# EAGLE design incandescentDriver (EAGLE 6.4)
DATABASE: ../partsdb.txt
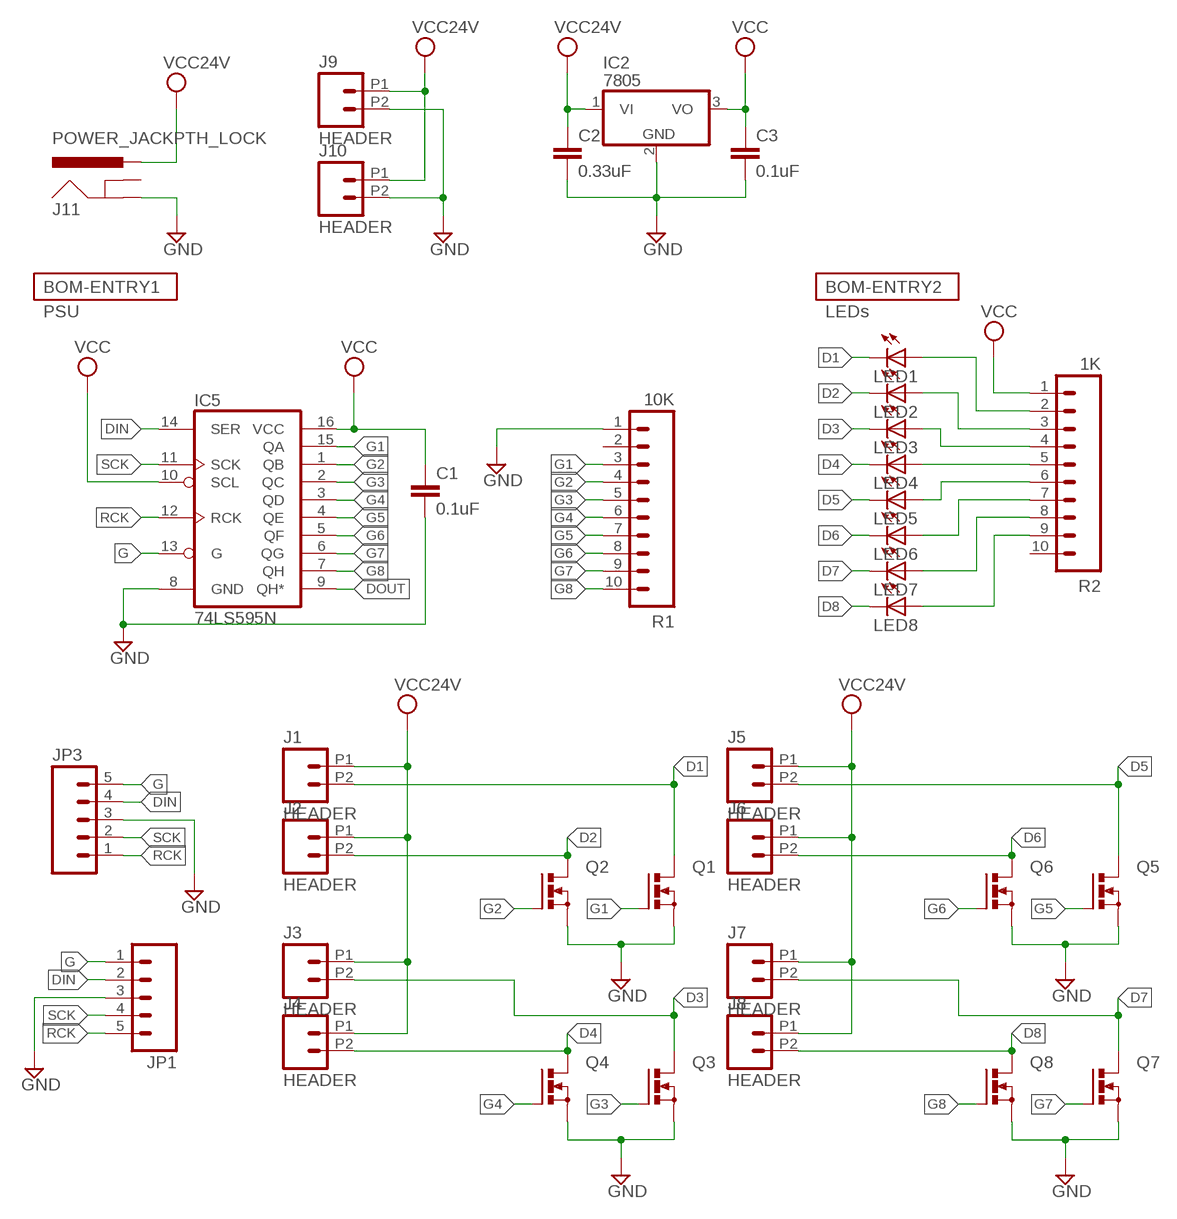
[diagram p0: schematic, sheet 1]
BOM-ENTRY1 (BOM-ENTRY): PARTNO: PSA-60W-240

## Parts
C1  0.1uF  CAPPTH  [CAP-PTH-SMALL]
C2  0.33uF  CAPPTH  [CAP-PTH-SMALL]
C3  0.1uF  CAPPTH  [CAP-PTH-SMALL]
IC2  7805  788TV  [TO220V]
IC5  74LS595N  [DIL16]
J1  HEADER  [1X02-5.08-SCREWTERM]
J2  HEADER  [1X02-5.08-SCREWTERM]
J3  HEADER  [1X02-5.08-SCREWTERM]
J4  HEADER  [1X02-5.08-SCREWTERM]
J5  HEADER  [1X02-5.08-SCREWTERM]
J6  HEADER  [1X02-5.08-SCREWTERM]
J7  HEADER  [1X02-5.08-SCREWTERM]
J8  HEADER  [1X02-5.08-SCREWTERM]
J9  HEADER  [1X02-5.08-SCREWTERM]
J10  HEADER  [1X02-5.08-SCREWTERM]
J11  POWER_JACKPTH_LOCK  [POWER_JACK_PTH_LOCK]
JP1  M05LOCK  [1X05_LOCK]
JP3  M05LOCK  [1X05_LOCK]
LED1  LED5MM  [LED5MM]
LED2  LED5MM  [LED5MM]
LED3  LED5MM  [LED5MM]
LED4  LED5MM  [LED5MM]
LED5  LED5MM  [LED5MM]
LED6  LED5MM  [LED5MM]
LED7  LED5MM  [LED5MM]
LED8  LED5MM  [LED5MM]
Q1  PMOSFET_NTO220BV  [TO220BV]
Q2  PMOSFET_NTO220BV  [TO220BV]
Q3  PMOSFET_NTO220BV  [TO220BV]
Q4  PMOSFET_NTO220BV  [TO220BV]
Q5  PMOSFET_NTO220BV  [TO220BV]
Q6  PMOSFET_NTO220BV  [TO220BV]
Q7  PMOSFET_NTO220BV  [TO220BV]
Q8  PMOSFET_NTO220BV  [TO220BV]
R1  10K  M10LOCK  [1X10_LOCK]
R2  1K  M10LOCK  [1X10_LOCK]

## Nets
D1 [power]: J1.P2 LED1.K(C) Q1.D
D2 [power]: J2.P2 LED2.K(C) Q2.D
D3 [power]: J3.P2 LED3.K(C) Q3.D
D4 [power]: J4.P2 LED4.K(C) Q4.D
D5 [power]: J5.P2 LED5.K(C) Q5.D
D6 [power]: J6.P2 LED6.K(C) Q6.D
D7 [power]: J7.P2 LED7.K(C) Q7.D
D8 [power]: J8.P2 LED8.K(C) Q8.D
DIN: IC5.14(SER) JP1.2 JP3.4
DOUT: IC5.9(QH*)
G: IC5.13(G) JP1.1 JP3.5
G1: IC5.15(QA) Q1.G R1.3
G2: IC5.1(QB) Q2.G R1.4
G3: IC5.2(QC) Q3.G R1.5
G4: IC5.3(QD) Q4.G R1.6
G5: IC5.4(QE) Q5.G R1.7
G6: IC5.5(QF) Q6.G R1.8
G7: IC5.6(QG) Q7.G R1.9
G8: IC5.7(QH) Q8.G R1.10
GND [power]: C1.2 C2.2 C3.2 IC2.2(GND) IC5.8(GND) J9.P2 J10.P2 J11.GND JP1.3 JP3.3 Q1.S Q2.S Q3.S Q4.S Q5.S Q6.S Q7.S Q8.S R1.1
N$1: LED1.A R2.2
N$2: LED2.A R2.3
N$3: LED3.A R2.4
N$4: LED4.A R2.5
N$5: LED5.A R2.6
N$6: LED6.A R2.7
N$7: LED7.A R2.8
N$8: LED8.A R2.9
RCK: IC5.12(RCK) JP1.5 JP3.1
SCK: IC5.11(SCK) JP1.4 JP3.2
VCC: C1.1 C3.1 IC2.3(VO) IC5.10(SCL) IC5.16(VCC) R2.1
VCC24V [power]: C2.1 IC2.1(VI) J1.P1 J2.P1 J3.P1 J4.P1 J5.P1 J6.P1 J7.P1 J8.P1 J9.P1 J10.P1 J11.PWR
Unconnected: J11.GNDBREAK R1.2 R2.10

## Library data of the parts
C1 C3 = SparkFun-Capacitors:CAP: Capacitor Standard 0603 ceramic capacitor, and 0.1" leaded capacitor.; PARTNO: SR295E104MAR
C2 = SparkFun-Capacitors:CAP: Capacitor Standard 0603 ceramic capacitor, and 0.1" leaded capacitor.; PARTNO: FK24X7R1H334K
IC2 = linear:78*: Positive VOLTAGE REGULATOR Source: http://cache.national.com/ds/LM/LM78L05.pdf http://www.fairchildsemi.com/ds/LM/LM7805.pdf; PARTNO: NCP7805TG
IC5 = SparkFun-DigitalIC:74*595: 8-bit SHIFT REGISTER, output latch; PARTNO: SN74HC164N
J1-J8 = Livestream:HEADER; PARTNO: OSTTC022162
J9 J10 = Livestream:HEADER; DNP: T; PARTNO: OSTTC022162
J11 = SparkFun-Connectors:POWER_JACK: Power Jack This is the standard 5.5mm barrel jack for power. The PTH is the most common, proven, reliable, footprint. The Slot footprint only works if the mill layer is transmitted to the PCB fab house so be warned. Spark Fun Electronics SKU : PRT-00119 SMT: CONN-08106 Mating wall wart : TOL-00298 (and others); PARTNO: PJ-202A
JP1 JP3 = SparkFun-Connectors:M05: Header 5 Standard 5-pin 0.1" header. Use with straight break away headers (SKU : PRT-00116), right angle break away headers (PRT-00553), swiss pins (PRT-00743), machine pins (PRT-00117), and female headers (PRT-00115). Molex polarized connector foot print use with SKU : PRT-08230 with associated crimp pins and housings.; PARTNO: M20-9960545
LED1-LED8 = adafruit:LED: LED OSRAM: - CHIPLED LG R971, LG N971, LY N971, LG Q971, LY Q971, LO R971, LY R971 LH N974, LH R974 LS Q976, LO Q976, LY Q976 LO Q996 - Hyper CHIPLED LW Q18S LB Q993, LB Q99A, LB R99A - SideLED LS A670, LO A670, LY A670, LG A670, LP A670 LB A673, LV A673, LT A673, LW A673 LH A674 LY A675 LS A676, LA A676, LO A676, LY A676, LW A676 LS A679, LY A679, LG A679 - Hyper Micro SIDELED® LS Y876, LA Y876, LO Y876, LY Y876 LT Y87S - SmartLED LW L88C, LW L88S LB L89C, LB L89S, LG L890 LS L89K, LO L89K, LY L89K LS L896, LA L896, LO L896, LY L896 - TOPLED LS T670, LO T670, LY T670, LG T670, LP T670 LSG T670, LSP T670, LSY T670, LOP T670, LYG T670 LG T671, LOG T671, LSG T671 LB T673, LV T673, LT T673, LW T673 LH T674 LS T676, LA T676, LO T676, LY T676, LB T676, LH T676, LSB T676, LW T676 LB T67C, LV T67C, LT T67C, LS T67K, LO T67K, LY T67K, LW E67C LS E67B, LA E67B, LO E67B, LY E67B, LB E67C, LV E67C, LT E67C LW T67C LS T679, LY T679, LG T679 LS T770, LO T770, LY T770, LG T770, LP T770 LB T773, LV T773, LT T773, LW T773 LH T774 LS E675, LA E675, LY E675, LS T675 LS T776, LA T776, LO T776, LY T776, LB T776 LHGB T686 LT T68C, LB T68C - Hyper Mini TOPLED® LB M676 - Mini TOPLED Santana® LG M470 LS M47K, LO M47K, LY M47K Source: http://www.osram.convergy.de/
Q1-Q8 = transistor-power:PMOSFET_N: Power MOSFET N-Channel; PARTNO: FQP13N10L
R1 = SparkFun-Connectors:M10: Header 10 Standard 10-pin 0.1" header. Use with straight break away headers (SKU : PRT-00116), right angle break away headers (PRT-00553), swiss pins (PRT-00743), machine pins (PRT-00117), and female headers (PRT-00115).; PARTNO: L101S103LF
R2 = SparkFun-Connectors:M10: Header 10 Standard 10-pin 0.1" header. Use with straight break away headers (SKU : PRT-00116), right angle break away headers (PRT-00553), swiss pins (PRT-00743), machine pins (PRT-00117), and female headers (PRT-00115).; PARTNO: 4609X-101-102LF

## Net classes
0 default: width 0.152 mm, drill 0.381 mm, clearance 0.152 mm
1 power: width 0.254 mm, drill 0.381 mm, clearance 0.152 mm

## Board
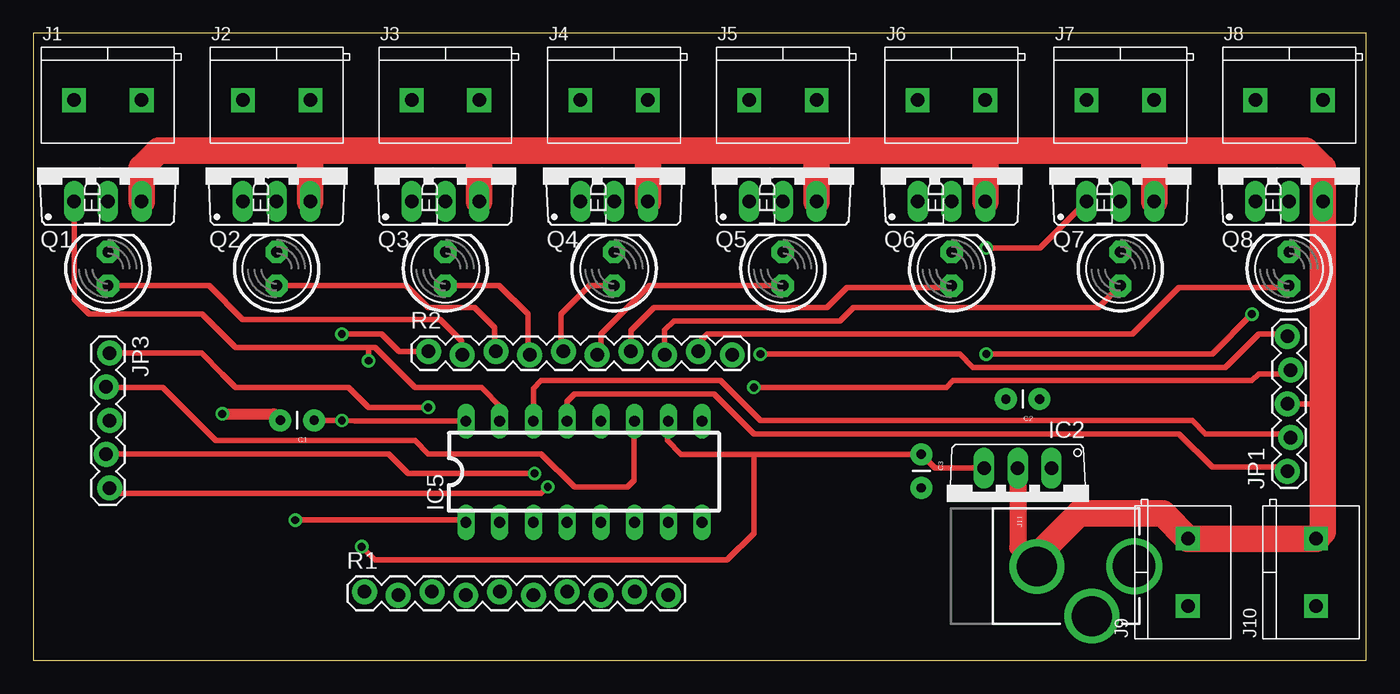
[diagram p1: board, top side]
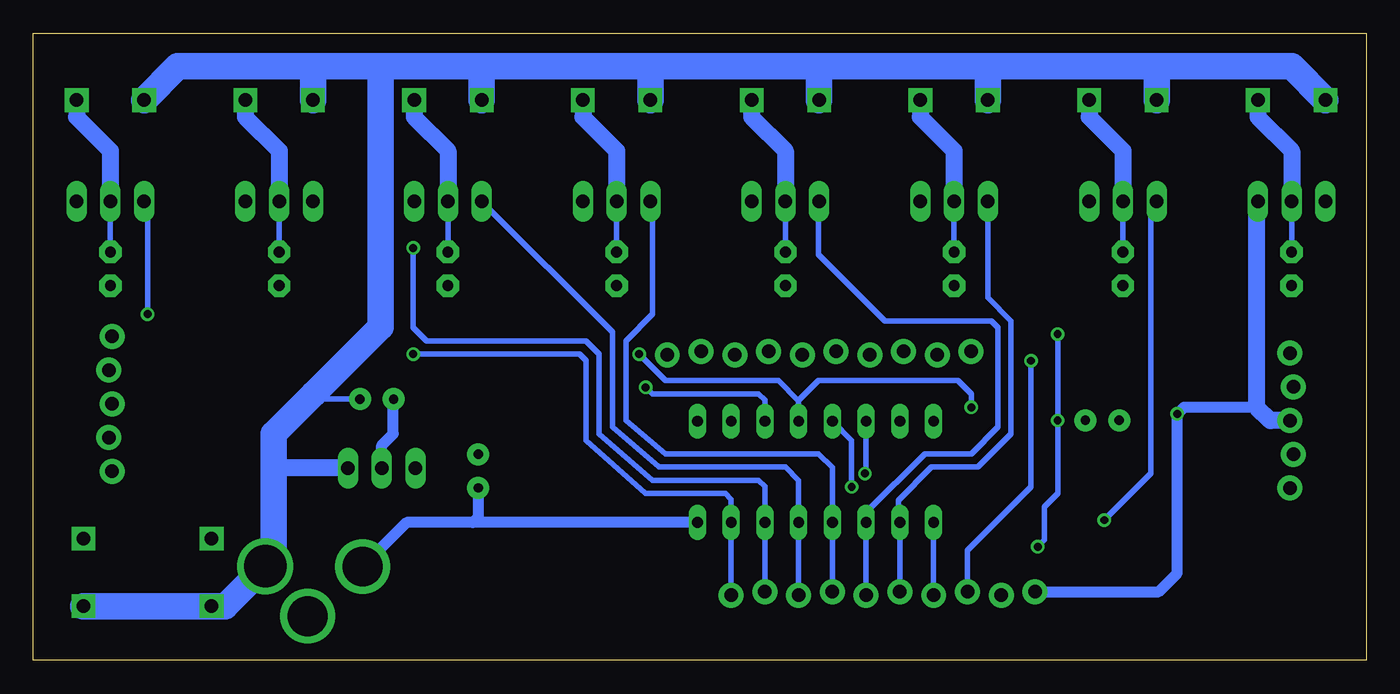
[diagram p2: board, bottom side, seen from below]

Size 100.33 x 47.22 mm. Coordinates in mm from the lower left corner, seen from the top.
Outline: 0,0 100.33,0 100.33,47.22 0,47.22 0,0
Copper layers (1*16): Top 0.035mm / dielectric 1.5mm / Bottom 0.035mm
Design rules "default": minimum track width 10mil, minimum drill 24mil, track to track 8mil, track to pad 8mil, pad to pad 8mil, via to via 8mil, smd to smd 8mil, copper to edge 40mil, drill to drill 8mil, minimum pad ring 10mil, minimum via ring 8mil, stop-mask expansion 4mil, vias tented up to drill 0mil, thermal gap 10mil

### Footprints (pad centres in the part's own frame; a part is rotated, then mirrored left to right if it is on the bottom)
CAP-PTH-SMALL = drill 0.7 pad 1.651: 1 0,0; 2 2.54,0
TO220V = drill 1.016 long: 1 -2.54,-2.54; 2 0,-2.54; 3 2.54,-2.54
DIL16 = drill 0.813 long: 1 -8.89,-3.81; 2 -6.35,-3.81; 3 -3.81,-3.81; 4 -1.27,-3.81; 5 1.27,-3.81; 6 3.81,-3.81; 7 6.35,-3.81; 8 8.89,-3.81; 9 8.89,3.81; 10 6.35,3.81; 11 3.81,3.81; 12 1.27,3.81; 13 -1.27,3.81; 14 -3.81,3.81; 15 -6.35,3.81; 16 -8.89,3.81
1X02-5.08-SCREWTERM = drill 1.016 pad 1.778 square: P1 -2.54,0; P2 2.54,0
POWER_JACK_PTH_LOCK = drill 2.997 pad 4.115: GND 0.025,6.557; GNDBREAK 3.762,10.7 | drill 3.2 pad 4.115: PWR 0,13.878
1X05_LOCK = drill 1.016 pad 1.88: 1 0,0.127; 2 2.54,-0.127; 3 5.08,0.127; 4 7.62,-0.127; 5 10.16,0.127
LED5MM = drill 0.813 pad 1.676 octagon: A -1.27,0; K 1.27,0
TO220BV = drill 1.016 long: D 0,-2.54; G -2.54,-2.54; S 2.54,-2.54
1X10_LOCK = drill 1.016 pad 1.88: 1 0,0.127; 2 2.54,-0.127; 3 5.08,0.127; 4 7.62,-0.127; 5 10.16,0.127; 6 12.7,-0.127; 7 15.24,0.127; 8 17.78,-0.127; 9 20.32,0.127; 10 22.86,-0.127

### Placement (x,y rotation side)
C1  21.14,18.08 180 top
C2  75.74,19.67 180 top
C3  66.84,15.52 270 top
IC2  74.1,11.94 180 top
IC5  41.45,14.2 0 top
J1  5.62,42.18 0 top
J2  18.32,42.18 0 top
J3  31.02,42.18 0 top
J4  43.72,42.18 0 top
J5  56.42,42.18 0 top
J6  69.12,42.18 0 top
J7  81.82,42.18 0 top
J8  94.52,42.18 0 top
J9  86.9,6.62 90 top
J10  96.56,6.62 90 top
J11  68.98,7.09 270 top
JP1  94.52,14.24 90 top
JP3  5.62,23.13 270 top
LED1  5.62,29.48 90 top
LED2  18.32,29.48 90 top
LED3  31.02,29.48 90 top
LED4  43.72,29.48 90 top
LED5  56.42,29.48 90 top
LED6  69.12,29.48 90 top
LED7  81.82,29.48 90 top
LED8  94.52,29.48 90 top
Q1  5.62,37.1 0 top
Q2  18.32,37.1 0 top
Q3  31.02,37.1 0 top
Q4  43.72,37.1 0 top
Q5  56.42,37.1 0 top
Q6  69.12,37.1 0 top
Q7  81.82,37.1 0 top
Q8  94.52,37.1 0 top
R1  24.94,5.04 0 top
R2  29.75,23.13 0 top

### Tracks (layer width: path | path; a pad name or v marks a point on that pad's centre or on a via)
D1
  Bottom 0.406: Q1.D LED1.K
  Bottom 1.27: J1.P2 8.16,40.91 5.62,38.37 Q1.D
D2
  Bottom 0.406: Q2.D LED2.K
  Bottom 1.27: J2.P2 20.86,40.91 18.32,38.37 Q2.D
D3
  Bottom 0.406: Q3.D LED3.K
  Bottom 1.27: J3.P2 33.56,40.91 31.02,38.37 Q3.D
D4
  Bottom 0.406: Q4.D LED4.K
  Bottom 1.27: J4.P2 46.26,40.91 43.72,38.37 Q4.D
D5
  Bottom 0.406: Q5.D LED5.K
  Bottom 1.27: J5.P2 58.96,40.91 56.42,38.37 Q5.D
D6
  Bottom 0.406: Q6.D LED6.K
  Bottom 1.27: J6.P2 71.66,40.91 69.12,38.37 Q6.D
D7
  Bottom 0.406: Q7.D LED7.K
  Bottom 1.27: J7.P2 84.36,40.91 81.82,38.37 Q7.D
D8
  Bottom 0.406: Q8.D LED8.K
  Bottom 1.27: J8.P2 97.06,40.91 94.52,38.37 Q8.D
DIN  (via drill 0.6)
  Top 0.406: JP3.4 5.54,15.56 26.73,15.56 28.23,14.06 v37.73,14.06 | IC5.14 37.64,20.47 38.23,21.06 51.73,21.06 54.73,18.06 87.23,18.06 88.23,17.06 94.37,17.06 JP1.2
  Bottom 0.406: v37.73,14.06 37.64,14.15 IC5.14
G  (via drill 0.6)
  Top 0.406: JP3.5 6.16,12.56 36.23,12.56 38.23,12.56 v38.73,13.06 | IC5.13 40.18,19.51 40.73,20.06 51.23,20.06 54.23,17.06 86.23,17.06 88.73,14.56 94.07,14.56 JP1.1
  Bottom 0.406: v38.73,13.06 38.73,16.56 IC5.13
G1  (via drill 0.6)
  Top 0.406: Q1.G 3.08,27.21 4.23,26.06 12.73,26.06 15.23,23.56 25.23,23.56 | 25.23,23.56 25.73,23.56 28.73,20.56 33.73,20.56 35.23,19.06 35.23,18.14 IC5.15 | v25.23,22.56 25.23,23.56
  Bottom 0.406: R1.3 30.02,8.27 25.23,13.06 v25.23,22.56
G2  (via drill 0.6)
  Top 0.406: v19.73,10.56 32.39,10.56 IC5.1
  Bottom 0.406: v19.73,10.56 16.23,14.06 16.23,27.06 16.23,34.11 Q2.G | 32.39,10.56 IC5.1 R1.4
G3
  Bottom 0.406: Q3.G 28.48,27.31 26.73,25.56 26.73,17.06 29.23,14.56 32.73,14.56 35.23,12.06 35.23,10.52 IC5.2 R1.5
G4
  Bottom 0.406: Q4.G 41.23,34.51 41.23,30.56 36.23,25.56 28.23,25.56 27.73,25.06 27.73,17.56 29.73,15.56 33.23,15.56 37.64,11.15 IC5.3 R1.6
G5
  Bottom 0.406: Q5.G 53.73,34.41 53.73,26.06 55.73,24.06 55.73,18.06 52.73,15.56 41.23,15.56 40.18,14.51 IC5.4 R1.7
G6
  Bottom 0.406: Q6.G 56.73,24.71 56.73,17.56 53.23,14.56 43.73,14.56 42.72,13.55 IC5.5 R1.8
G7  (via drill 0.6)
  Top 0.406: v71.73,31.06 75.78,31.06 Q7.G
  Bottom 0.406: v71.73,31.06 71.73,25.06 70.73,24.06 58.73,24.06 57.73,23.06 57.73,17.06 53.73,13.56 45.73,13.56 45.26,13.09 IC5.6 R1.9
G8  (via drill 0.6)
  Top 0.406: v71.73,23.06 88.73,23.06 v91.73,26.06
  Bottom 0.406: v71.73,23.06 59.23,23.06 58.73,22.56 58.73,16.56 54.23,12.56 48.23,12.56 47.8,12.13 IC5.7 R1.10 | v91.73,26.06 91.73,34.31 Q8.G
GND  (via drill 0.6)
  Top 0.406: JP1.3 96.8,19.32 97.06,19.06
  Top 0.813: v14.23,18.56 18.12,18.56 C1.2
  Top 1.27: IC2.2 74.1,8.5 J11.GND
  Top 2: Q1.S 8.16,37.1 9.43,38.37 20.86,38.37 | 20.86,38.37 33.56,38.37 | 33.56,38.37 46.26,38.37 | 46.26,38.37 58.96,38.37 | 58.96,38.37 71.66,38.37 | 71.66,38.37 84.36,38.37 | 84.36,38.37 95.79,38.37 97.06,37.1 97.06,35.06 | 97.06,35.06 Q8.S | Q2.S 20.86,38.37 | Q3.S 33.56,38.37 | Q4.S 46.26,38.37 | Q5.S 58.96,38.37 | Q6.S 71.66,38.37 | Q7.S 84.36,37.1 84.36,38.37 | 97.06,35.06 97.06,19.06 97.06,9.66 J10.P2 J9.P2 85,11.06 78.73,11.06 75.54,7.87 J11.GND
  Bottom 0.813: 8.23,19.06 13.73,19.06 v14.23,18.56 14.23,6.56 15.62,5.17 R1.1 | IC5.8 67.23,10.39 | 67.23,10.39 72.21,10.39 J11.GND | C3.2 66.84,10.78 67.23,10.39 | IC2.2 74.1,16.19 73.23,17.06 73.23,19.64 C2.2
  Bottom 1.27: JP3.3 7.22,18.05 8.23,19.06 8.23,34.49 Q1.S
N$1
  Top 0.406: LED1.A 13.24,28.21 15.78,25.67 30.62,25.67 32.23,24.06 32.23,23.06 R2.2
N$2
  Top 0.406: LED2.A 28.08,28.21 29.73,26.56 33.23,26.56 34.73,25.06 34.73,23.36 R2.3
N$3
  Top 0.406: LED3.A 35.08,28.21 37.23,26.06 37.23,23.14 R2.4
N$4
  Top 0.406: LED4.A 41.88,28.21 39.73,26.06 39.73,23.44 R2.5
N$5
  Top 0.406: LED5.A 46.38,28.21 42.73,24.56 42.73,23.28 R2.6
N$6
  Top 0.406: R2.7 44.99,24.82 46.73,26.56 59.73,26.56 61.23,28.06 68.97,28.06 LED6.A
N$7
  Top 0.406: R2.8 47.53,24.86 48.23,25.56 60.73,25.56 61.73,26.56 80.17,26.56 LED7.A
N$8
  Top 0.406: R2.9 50.07,23.9 50.73,24.56 82.73,24.56 86.23,28.06 94.37,28.06 LED8.A
RCK  (via drill 0.6)
  Top 0.406: JP3.1 12.66,23.13 14.23,21.56 15.23,20.56 23.73,20.56 25.23,19.06 27.73,19.06 v29.73,19.06 | v54.73,23.06 69.73,23.06 70.73,22.06 89.73,22.06 92.23,24.56 94.23,24.56 JP1.5
  Bottom 0.406: v29.73,19.06 29.73,20.06 30.73,21.06 41.23,21.06 42.73,19.56 IC5.12 42.72,19.55 44.23,21.06 52.73,21.06 v54.73,23.06
SCK  (via drill 0.6)
  Top 0.406: 45.26,17.09 IC5.11 45.23,17.98 45.23,13.56 44.73,13.06 40.73,13.06 38.23,15.56 29.73,15.56 28.73,16.56 13.73,16.56 9.73,20.56 5.52,20.56 JP3.2 | JP1.4 94.35,21.56 92.23,21.56 91.73,21.06 69.23,21.06 68.73,20.56 v54.23,20.56
  Bottom 0.406: IC5.11 45.26,19.59 45.73,20.06 52.23,20.06 53.73,20.06 v54.23,20.56
VCC  (via drill 0.6)
  Top 0.406: IC2.3 67.88,14.48 C3.1 54.23,15.52 | 54.23,15.52 48.77,15.52 47.73,16.56 47.73,17.94 IC5.10 | IC5.16 24.18,18.01 v23.23,18.06 21.16,18.06 C1.1 | 54.23,15.52 54.23,9.56 52.23,7.56 25.73,7.56 v24.73,8.56 | R2.1 27.53,23.26 26.23,24.56 v23.23,24.56
  Bottom 0.406: v23.23,24.56 v23.23,18.06 23.23,12.56 24.23,11.56 24.23,9.06 v24.73,8.56
VCC24V
  Bottom 0.406: C2.1 78.84,19.67 79.23,20.06
  Bottom 1.27: IC2.1 81.65,14.48 81.73,14.56 82.23,14.56
  Bottom 2: 74.2,44.72 66.58,44.72 | 66.58,44.72 53.88,44.72 | 53.88,44.72 41.18,44.72 | 41.18,44.72 28.48,44.72 | 28.48,44.72 15.78,44.72 | 15.78,44.72 5.62,44.72 J1.P1 | J2.P1 15.78,44.72 | J3.P1 28.48,44.72 | J4.P1 41.18,44.72 | J5.P1 53.88,44.72 | J6.P1 66.58,43.45 66.58,44.72 | 74.2,44.72 79.28,44.72 | 79.28,44.72 89.44,44.72 J8.P1 | J7.P1 79.28,44.72 | 74.2,44.72 74.2,25.09 79.23,20.06 82.23,17.06 82.23,14.56 82.23,7.72 J11.PWR 85.87,4.08 J9.P1 J10.P1